# Altium project RIO_rev1.PrjPcb
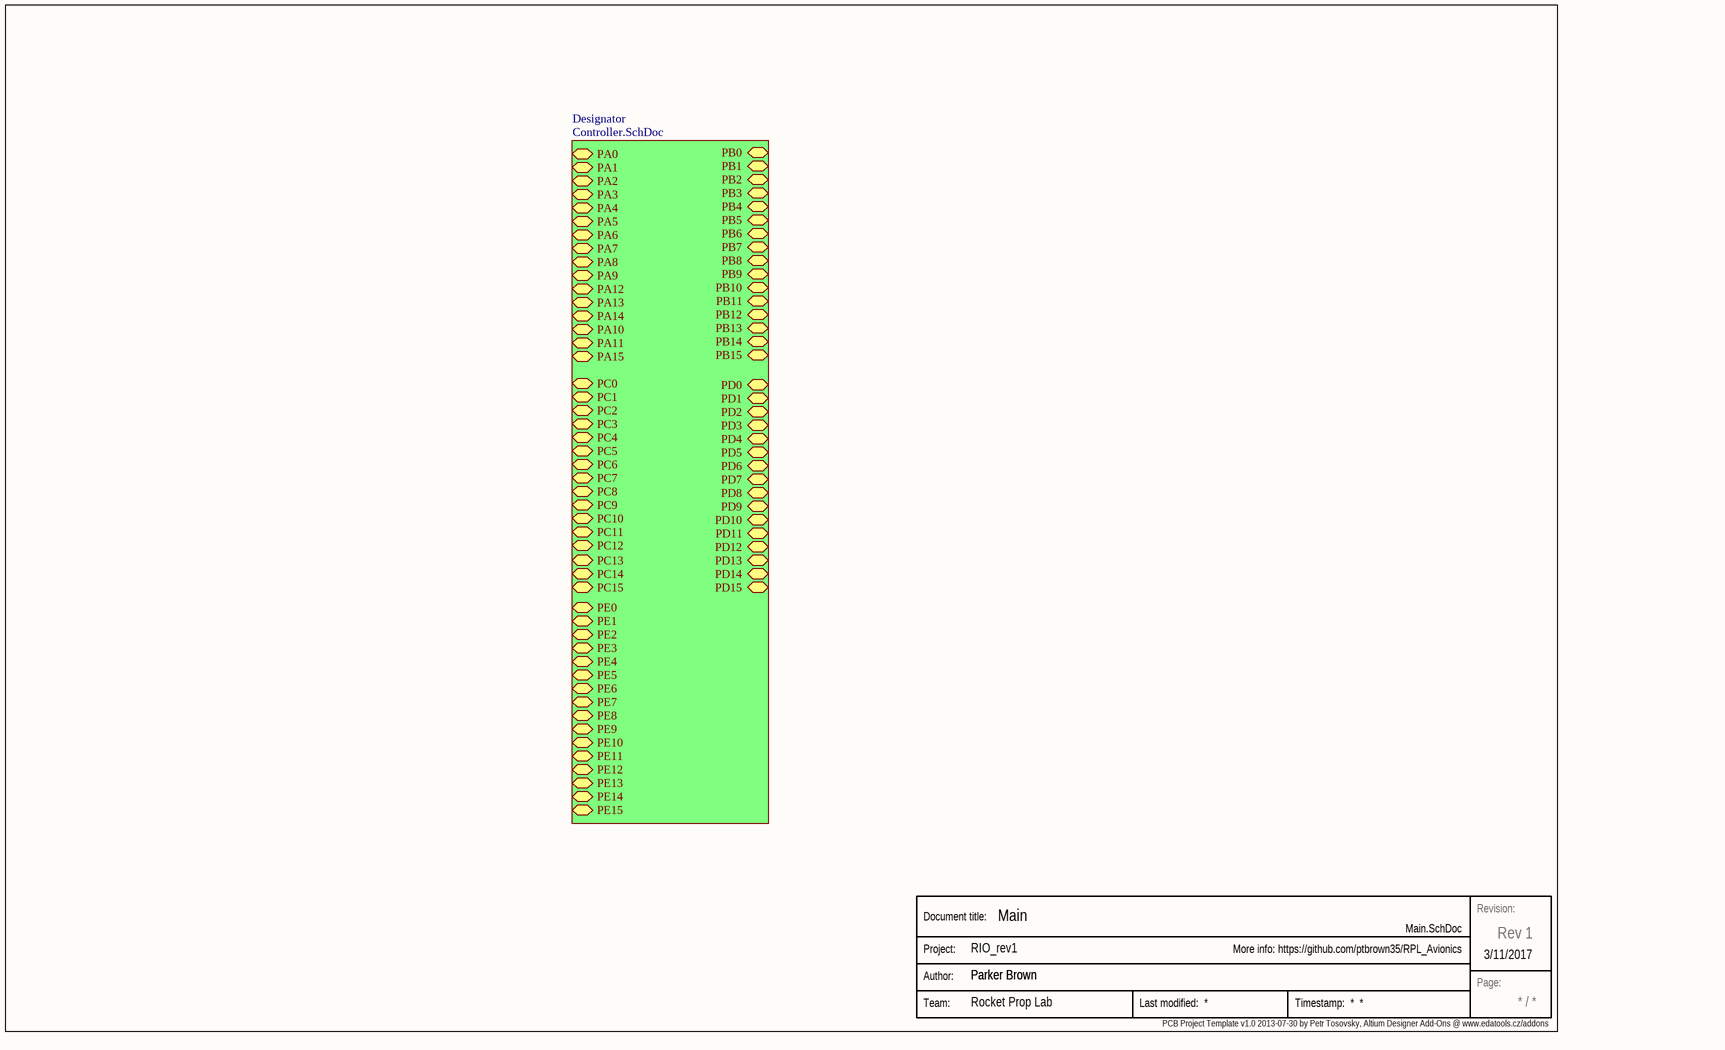
[diagram p0: Main.SchDoc]
GlobalRevisionDate: 3/11/2017; GlobalProjectTeam: Rocket Prop Lab; GlobalProjectRevision: Rev 1; GlobalProjectName: RIO_rev1; GlobalProjectLink: https://github.com/ptbrown35/RPL_Avionics
6 sheets, 8 parts. Net scope: hierarchical (ports join the sheet entries above them; power ports are global).
Board file: RIO_rev1.PcbDoc
Sheets:
  Main.SchDoc
    Designator = Controller.SchDoc
  Ethernet.SchDoc
  ADC.SchDoc
  BMP280.SchDoc
  Connectors.SchDoc

## Sheet Main.SchDoc: Main
size A4; Author: Parker Brown

### Parts
(Parts that share a designator on the sheet are numbered #1, #2 ... from top to bottom, then left to right.)
Stamp#1  Stamp  (value not drawn)  (graphical)

### Sub-sheets
Designator = Controller.SchDoc: PA0, PA1, PA2, PA3, PA4, PA5, PA6, PA7, PA8, PA9, PA12, PA13, PA14, PA10, PA11, PA15, PC0, PC1, PC2, PC3, PC4, PC5, PC6, PC7, PC8, PC9, PC13, PC14, PC15, PC11, PC12, PC10, PE0, PE1, PE2, PE3, PE4, PE5, PE6, PE7, PE8, PE9, PE10, PE11, PE12, PE13, PE14, PE15, PB0, PB1, PB2, PB3, PB4, PB5, PB6, PB7, PB8, PB9, PB10, PB11, PB12, PB13, PB14, PB15, PD0, PD1, PD2, PD3, PD4, PD5, PD6, PD7, PD8, PD9, PD10, PD11, PD12, PD13, PD14, PD15

### Notes on the sheet
- PCB Project Template v1.0 2013-07-30 by Petr Tosovsky, Altium Designer Add-Ons @ www.edatools.cz/addons <http://www.edatools.cz/addons>
- (in symbol Stamp) Revision:; Document title:; Project:; Author:; Page:; Team:

## Sheet Controller.SchDoc: Set in Document Options » Parameters » Title
size A4; Author: Set in Document Options » Parameters » Author + Contact info
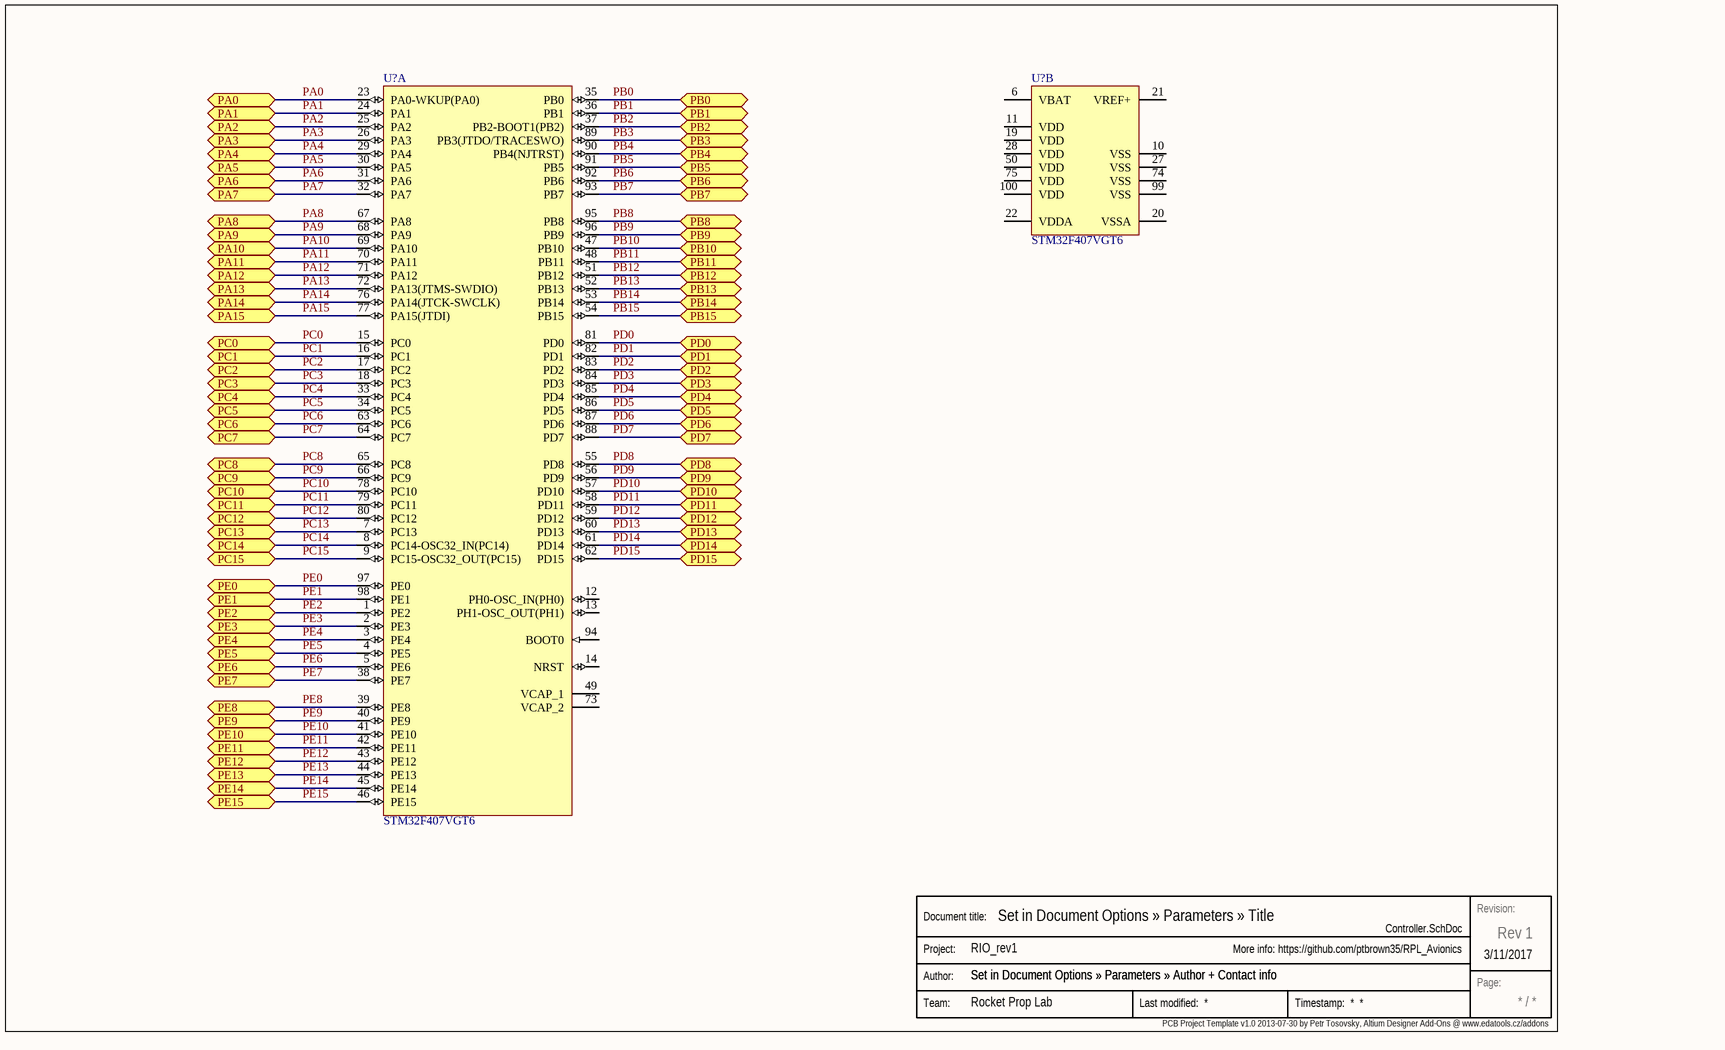
[diagram p1: Controller.SchDoc]

### Parts
(Parts that share a designator on the sheet are numbered #1, #2 ... from top to bottom, then left to right.)
Stamp#2  Stamp  (value not drawn)  (graphical)
U?#1  STM32F407VGT6  [STM-LQFP100_N]  (part A of 2)
U?#2  STM32F407VGT6  [STM-LQFP100_N]  (part B of 2)

### Ports
PA0, PA1, PA2, PA3, PA4, PA5, PA6, PA7, PA8, PA9, PA10, PA11, PA12, PA13, PA14, PA15, PB0, PB1, PB2, PB3, PB4, PB5, PB6, PB7, PB8, PB9, PB10, PB11, PB12, PB13, PB14, PB15, PC0, PC1, PC2, PC3, PC4, PC5, PC6, PC7, PC8, PC9, PC10, PC11, PC12, PC13, PC14, PC15, PD0, PD1, PD2, PD3, PD4, PD5, PD6, PD7, PD8, PD9, PD10, PD11, PD12, PD13, PD14, PD15, PE0, PE1, PE2, PE3, PE4, PE5, PE6, PE7, PE8, PE9, PE10, PE11, PE12, PE13, PE14, PE15

### Nets
PA0: U?#1.23(PA0-WKUP(PA0)) ; port PA0
PA1: U?#1.24(PA1) ; port PA1
PA2: U?#1.25(PA2) ; port PA2
PA3: U?#1.26(PA3) ; port PA3
PA4: U?#1.29(PA4) ; port PA4
PA5: U?#1.30(PA5) ; port PA5
PA6: U?#1.31(PA6) ; port PA6
PA7: U?#1.32(PA7) ; port PA7
PA8: U?#1.67(PA8) ; port PA8
PA9: U?#1.68(PA9) ; port PA9
PA10: U?#1.69(PA10) ; port PA10
PA11: U?#1.70(PA11) ; port PA11
PA12: U?#1.71(PA12) ; port PA12
PA13: U?#1.72(PA13(JTMS-SWDIO)) ; port PA13
PA14: U?#1.76(PA14(JTCK-SWCLK)) ; port PA14
PA15: U?#1.77(PA15(JTDI)) ; port PA15
PB0: U?#1.35(PB0) ; port PB0
PB1: U?#1.36(PB1) ; port PB1
PB2: U?#1.37(PB2-BOOT1(PB2)) ; port PB2
PB3: U?#1.89(PB3(JTDO/TRACESWO)) ; port PB3
PB4: U?#1.90(PB4(NJTRST)) ; port PB4
PB5: U?#1.91(PB5) ; port PB5
PB6: U?#1.92(PB6) ; port PB6
PB7: U?#1.93(PB7) ; port PB7
PB8: U?#1.95(PB8) ; port PB8
PB9: U?#1.96(PB9) ; port PB9
PB10: U?#1.47(PB10) ; port PB10
PB11: U?#1.48(PB11) ; port PB11
PB12: U?#1.51(PB12) ; port PB12
PB13: U?#1.52(PB13) ; port PB13
PB14: U?#1.53(PB14) ; port PB14
PB15: U?#1.54(PB15) ; port PB15
PC0: U?#1.15(PC0) ; port PC0
PC1: U?#1.16(PC1) ; port PC1
PC2: U?#1.17(PC2) ; port PC2
PC3: U?#1.18(PC3) ; port PC3
PC4: U?#1.33(PC4) ; port PC4
PC5: U?#1.34(PC5) ; port PC5
PC6: U?#1.63(PC6) ; port PC6
PC7: U?#1.64(PC7) ; port PC7
PC8: U?#1.65(PC8) ; port PC8
PC9: U?#1.66(PC9) ; port PC9
PC10: U?#1.78(PC10) ; port PC10
PC11: U?#1.79(PC11) ; port PC11
PC12: U?#1.80(PC12) ; port PC12
PC13: U?#1.7(PC13) ; port PC13
PC14: U?#1.8(PC14-OSC32_IN(PC14)) ; port PC14
PC15: U?#1.9(PC15-OSC32_OUT(PC15)) ; port PC15
PD0: U?#1.81(PD0) ; port PD0
PD1: U?#1.82(PD1) ; port PD1
PD2: U?#1.83(PD2) ; port PD2
PD3: U?#1.84(PD3) ; port PD3
PD4: U?#1.85(PD4) ; port PD4
PD5: U?#1.86(PD5) ; port PD5
PD6: U?#1.87(PD6) ; port PD6
PD7: U?#1.88(PD7) ; port PD7
PD8: U?#1.55(PD8) ; port PD8
PD9: U?#1.56(PD9) ; port PD9
PD10: U?#1.57(PD10) ; port PD10
PD11: U?#1.58(PD11) ; port PD11
PD12: U?#1.59(PD12) ; port PD12
PD13: U?#1.60(PD13) ; port PD13
PD14: U?#1.61(PD14) ; port PD14
PD15: U?#1.62(PD15) ; port PD15
PE0: U?#1.97(PE0) ; port PE0
PE1: U?#1.98(PE1) ; port PE1
PE2: U?#1.1(PE2) ; port PE2
PE3: U?#1.2(PE3) ; port PE3
PE4: U?#1.3(PE4) ; port PE4
PE5: U?#1.4(PE5) ; port PE5
PE6: U?#1.5(PE6) ; port PE6
PE7: U?#1.38(PE7) ; port PE7
PE8: U?#1.39(PE8) ; port PE8
PE9: U?#1.40(PE9) ; port PE9
PE10: U?#1.41(PE10) ; port PE10
PE11: U?#1.42(PE11) ; port PE11
PE12: U?#1.43(PE12) ; port PE12
PE13: U?#1.44(PE13) ; port PE13
PE14: U?#1.45(PE14) ; port PE14
PE15: U?#1.46(PE15) ; port PE15

Not connected (* = marked no-connect by the designer): U?#1 12(PH0-OSC_IN(PH0)) 13(PH1-OSC_OUT(PH1)) 14(NRST) 49(VCAP_1) 73(VCAP_2) 94(BOOT0); U?#2 6(VBAT) 10(VSS) 11(VDD) 19(VDD) 20(VSSA) 21(VREF+) 22(VDDA) 27(VSS) 28(VDD) 50(VDD) 74(VSS) 75(VDD) 99(VSS) 100(VDD)

### Notes on the sheet
- PCB Project Template v1.0 2013-07-30 by Petr Tosovsky, Altium Designer Add-Ons @ www.edatools.cz/addons <http://www.edatools.cz/addons>
- (in symbol Stamp) Revision:; Document title:; Project:; Author:; Page:; Team:

### Library data of the parts
U?#1 U?#2 = STM32F407VGT6: ARM Cortex-M4 32-bit MCU+FPU, 210 DMIPS, 1024 kB Flash, 192 kB Internal RAM, 82 I/Os, 100-pin LQFP, -40 to 85 degC, Tray; Manufacturer: STMicroelectronics; D/A Converter: 2x12-bit; FLASH Size (Prog) (kB): 1024; I/Os (High Current): 82; Internal RAM Size (kB): 192; Operating Frequency(F) (Processor speed) (MHz): 168; Supply Voltage(Vcc) max (V): 3.6; Supply Voltage(Vcc) min (V): 1.8; DatasheetVersion: Rev. 4; PackageVersion: Rev. 1, 06/2013; PackageReference: LQFP100; PackageDescription: 100-Pin Low Profile Quad Flat Package, 14 x 14 mm Body, 0.5 mm Pitch; Supplier 1: Digi-Key; Supplier Part Number 1: 497-11605-ND; Supplier 2: Farnell; Supplier Part Number 2: 2064368; Supplier 3: Newark; Supplier Part Number 3: 73T2333; Supplier 4: Mouser; Supplier Part Number 4: 511-STM32F407VGT6; Core: ARM Cortex-M4; Packing: Tray; Mounting Technology: Surface Mount; PartNumber: STM32F407VGT6; ComponentLink1Description: Manufacturer URL; ComponentLink1URL: http://www.st.com/web/en/home.html; ComponentLink2Description: Datasheet; ComponentLink2URL: http://www.st.com/st-web-ui/static/active/en/resource/technical/document/datasheet/DM00037051.pdf; ComponentLink3Description: Package Specification; ComponentLink3URL: http://www.st.com/st-web-ui/static/active/en/resource/technical/document/data_brief/DM00071938.pdf

## Sheet Ethernet.SchDoc: Set in Document Options » Parameters » Title
size A4; Author: Set in Document Options » Parameters » Author + Contact info
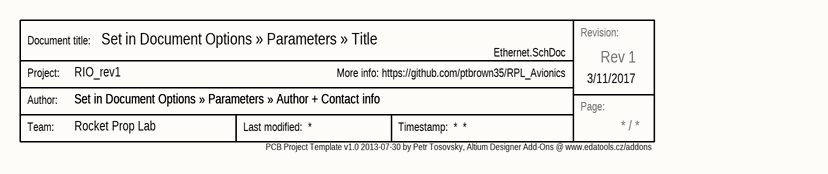
[diagram p2: Ethernet.SchDoc]

### Parts
(Parts that share a designator on the sheet are numbered #1, #2 ... from top to bottom, then left to right.)
Stamp#3  Stamp  (value not drawn)  (graphical)

### Notes on the sheet
- PCB Project Template v1.0 2013-07-30 by Petr Tosovsky, Altium Designer Add-Ons @ www.edatools.cz/addons <http://www.edatools.cz/addons>
- (in symbol Stamp) Revision:; Document title:; Project:; Author:; Page:; Team:

## Sheet ADC.SchDoc: Set in Document Options » Parameters » Title
size A4; Author: Set in Document Options » Parameters » Author + Contact info
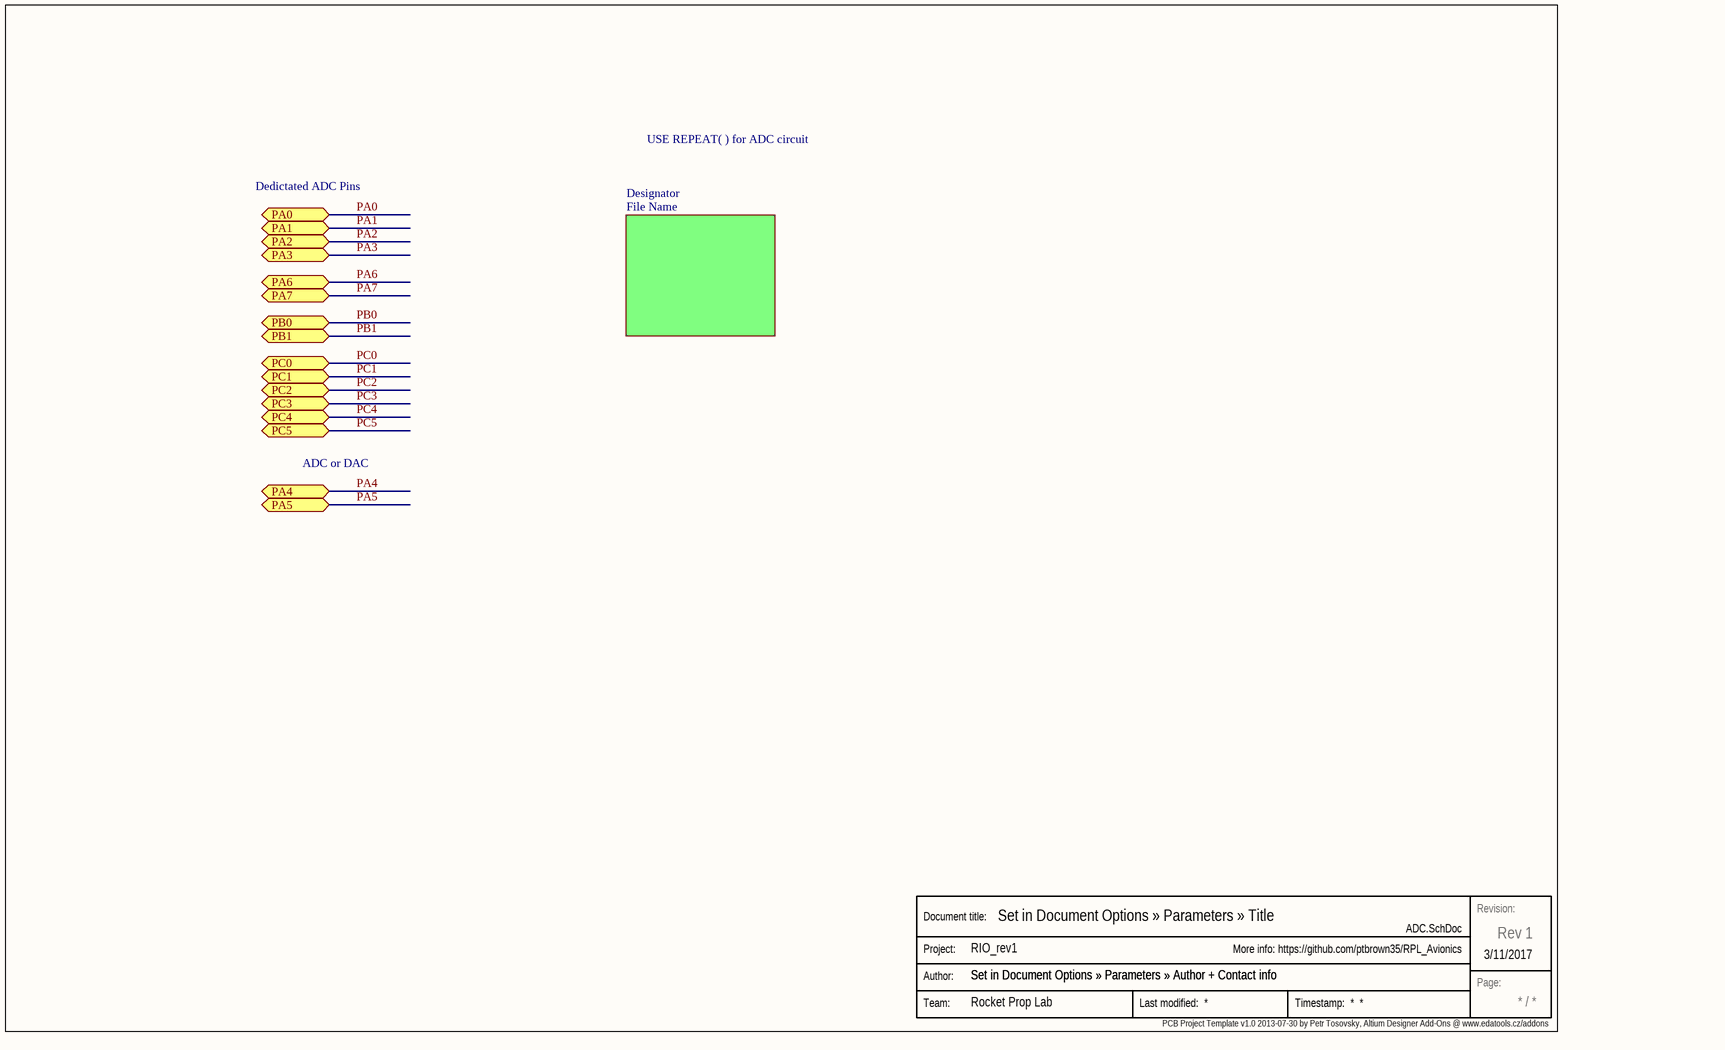
[diagram p3: ADC.SchDoc]

### Parts
(Parts that share a designator on the sheet are numbered #1, #2 ... from top to bottom, then left to right.)
Stamp#4  Stamp  (value not drawn)  (graphical)

### Sub-sheets
Designator = File Name (file not in this document): no entries

### Ports
PA0, PA1, PA2, PA3, PA4, PA5, PA6, PA7, PB0, PB1, PC0, PC1, PC2, PC3, PC4, PC5

### Notes on the sheet
- USE REPEAT( ) for ADC circuit
- Dedictated ADC Pins
- ADC or DAC
- PCB Project Template v1.0 2013-07-30 by Petr Tosovsky, Altium Designer Add-Ons @ www.edatools.cz/addons <http://www.edatools.cz/addons>
- (in symbol Stamp) Revision:; Document title:; Project:; Author:; Page:; Team:

## Sheet BMP280.SchDoc: Set in Document Options » Parameters » Title
size A4; Author: Set in Document Options » Parameters » Author + Contact info
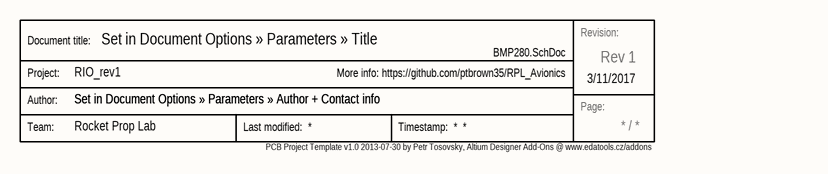
[diagram p4: BMP280.SchDoc]

### Parts
(Parts that share a designator on the sheet are numbered #1, #2 ... from top to bottom, then left to right.)
Stamp#5  Stamp  (value not drawn)  (graphical)

### Notes on the sheet
- PCB Project Template v1.0 2013-07-30 by Petr Tosovsky, Altium Designer Add-Ons @ www.edatools.cz/addons <http://www.edatools.cz/addons>
- (in symbol Stamp) Revision:; Document title:; Project:; Author:; Page:; Team:

## Sheet Connectors.SchDoc: Set in Document Options » Parameters » Title
size A4; Author: Set in Document Options » Parameters » Author + Contact info
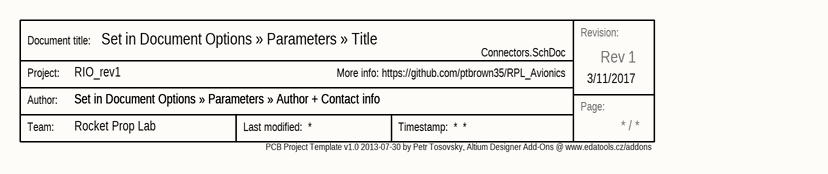
[diagram p5: Connectors.SchDoc]

### Parts
(Parts that share a designator on the sheet are numbered #1, #2 ... from top to bottom, then left to right.)
Stamp#6  Stamp  (value not drawn)  (graphical)

### Notes on the sheet
- PCB Project Template v1.0 2013-07-30 by Petr Tosovsky, Altium Designer Add-Ons @ www.edatools.cz/addons <http://www.edatools.cz/addons>
- (in symbol Stamp) Revision:; Document title:; Project:; Author:; Page:; Team: